# Altium schematic sheet PulseGenerator.SchDoc
size A4; SheetNumber: 1; SheetTotal: 1
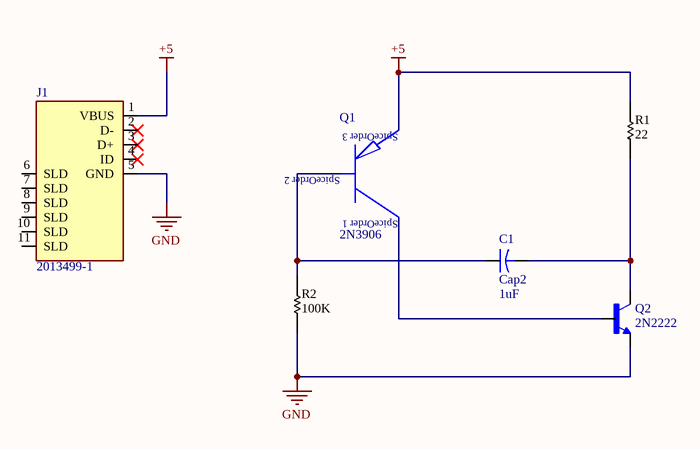
[diagram p0: PulseGenerator.SchDoc]

## Parts
C1  Cap2  value 1uF  [CAPR5-4X5]
J1  2013499-1  [TE_2013499-1]
Q1  2N3906  [TO92]
Q2  2N2222  [TO127P580H530-3]
R1  22  [RES1016-6800X250_PHO]
R2  100K  [RES1016-6800X250_PHO]

## Nets
+5: J1.1(VBUS) Q1.3(E) R1.2
GND: J1.5(GND) Q2.1(E) R2.1
NetC1_1: C1.1 Q1.2(B) R2.2
NetC1_2: C1.2 Q2.3(C) R1.1
NetQ1_1: Q1.1(C) Q2.2(B)

Not connected (* = marked no-connect by the designer): J1 2(D-)* 3(D+)* 4(ID)* 6(SLD) 7(SLD) 8(SLD) 9(SLD) 10(SLD) 11(SLD)

## Notes on the sheet
- (in symbol 2N3906) SpiceOrder 3; SpiceOrder 2; SpiceOrder 1

## Library data of the parts
C1 = Cap2: Capacitor; Published: 23-Sep-2002; PackageReference: CAPR5-4X5; Publisher: Altium Limited; PackageDescription: Capacitor; 2 Leads
J1 = 2013499-1: Conn Micro USB 2.0 Type B RCP 5 POS 0.65mm Solder RA SMD 5 Terminal 1 Port T/R; Centerline_Pitch: .65 mm[.025 in]; Number_of_Positions: 5; Product_Type: Connector; MF: TE Connectivity; Price: None; SnapEDA_Link: https://www.snapeda.com/parts/2013499-1/TE%20Connectivity%20AMP%20Connectors/view-part/779144/?ref=snap; MP: 2013499-1; Availability: Unavailable; Value: *; TE_purchase_URL: https://www.te.com/usa-en/product-2013499-1.html?te_bu=Cor&te_type=disp&te_campaign=seda_glo_cor-seda-global-disp-prtnr-fy19-seda-model-bom-cta_sma-317_1&elqCampaignId=32493; Package: None
Q1 = 2N3906: Bipolar _BJT_ Transistor PNP 40V 200mA 250MHz 625mW Through Hole TO-92; MF: Diotec Semiconductor; Package: TO-226-3 Diotec Semiconductor; Availability: Unavailable; MP: 2N3906; Value: *; SnapEDA_Link: https://www.snapeda.com/parts/2N3906/Diotec/view-part/4593480/?ref=snap; Price: None
Q2 = 2N2222: Bipolar _BJT_ Transistor NPN 50V 800mA 500mW Through Hole TO-18 _TO-206AA_; MF: MICROSS/On Semiconductor; Value: *; Package: TO-18-3 NJS; Digi-Key_Purchase_URL: https://www.digikey.com.mx/product-detail/en/microsemi-corporation/JANS2N2222A/1086-15156-ND/4384334?utm_source=snapeda&utm_medium=aggregator&utm_campaign=symbol; SnapEDA_Link: https://www.snapeda.com/parts/2N2222/MICROSS/On%20Semiconductor/view-part/561967/?ref=snap; Digi-Key_Part_Number: 1086-15156-ND; MP: 2N2222
R1 R2 = 0ohm_MCF0.25W0R_MUL: RESISTOR, ZERO OHM LINK   Resistance:0R; Power rating:0.25W; Resistor element type:Carbon Film; Voltage, rating:250V dc; Case style:Axial; Diameter, body:2.5mm; Length / Height, external:6.8mm; Voltage rating, DC:250V; Manufacturer_A: MULTICOMP; Value_A: 0ohm; Package_A: 6.8x2.5mm; ComponentLink1Description: Datasheet; ComponentLink1URL: DATASHEETS\MCF.pdf; PartNumber_A: MCF0.25W0R; Code_A: *; Price_A: *; Purchased: *; Supplier_B: *; Code_B: *; Price_B: *; PartNumber_B: *; Value_B: *; Package_B: *; Manufacturer_B: *